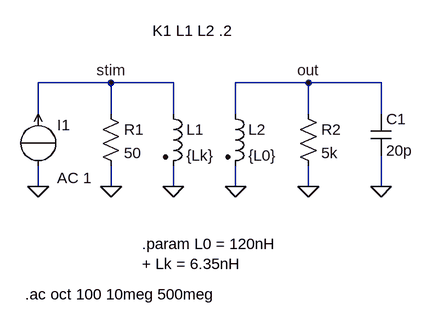
[diagram p0: schematic transformatorische_ankopplung_schwingkreis.asc]
transformatorische_ankopplung_schwingkreis.asc, the LTspice schematic file:
Version 4
SHEET 1 880 680
WIRE 176 80 64 80
WIRE 272 80 176 80
WIRE 480 80 368 80
WIRE 592 80 480 80
WIRE 64 128 64 80
WIRE 176 128 176 80
WIRE 272 128 272 80
WIRE 368 128 368 80
WIRE 480 128 480 80
WIRE 592 128 592 80
WIRE 64 240 64 208
WIRE 176 240 176 208
WIRE 272 240 272 208
WIRE 368 240 368 208
WIRE 480 240 480 208
WIRE 592 240 592 192
FLAG 64 240 0
FLAG 176 240 0
FLAG 272 240 0
FLAG 368 240 0
FLAG 480 240 0
FLAG 592 240 0
FLAG 176 80 stim
FLAG 480 80 out
SYMBOL MDB_sym\\source-I 64 128 R0
WINDOW 123 29 99 Left 2
WINDOW 39 0 0 Left 2
SYMATTR InstName I1
SYMATTR Value ""
SYMATTR Value2 AC 1
SYMBOL res 160 112 R0
SYMATTR InstName R1
SYMATTR Value 50
SYMBOL ind2 256 112 R0
SYMATTR InstName L1
SYMATTR Value {Lk}
SYMATTR Type ind
SYMBOL ind2 352 112 R0
SYMATTR InstName L2
SYMATTR Value {L0}
SYMATTR Type ind
SYMBOL res 464 112 R0
SYMATTR InstName R2
SYMATTR Value 5k
SYMBOL cap 576 128 R0
SYMATTR InstName C1
SYMATTR Value 20p
TEXT 240 0 Left 2 !K1 L1 L2 .2
TEXT 224 328 Left 2 !.param L0 = 120nH\n+ Lk = 6.35nH
TEXT 44 406 Left 2 !.ac oct 100 10meg 500meg

The netlist it stands for:
* transformatorische_ankopplung_schwingkreis.asc
I1 0 stim AC 1
R1 stim 0 50
L1 stim 0 {Lk}
L2 out 0 {L0}
R2 out 0 5k
C1 out 0 20p
K1 L1 L2 .2
.param L0 = 120nH
+ Lk = 6.35nH
.ac oct 100 10meg 500meg
.backanno
.end